# Altium schematic sheet Tegra_CSI.SchDoc
size A4
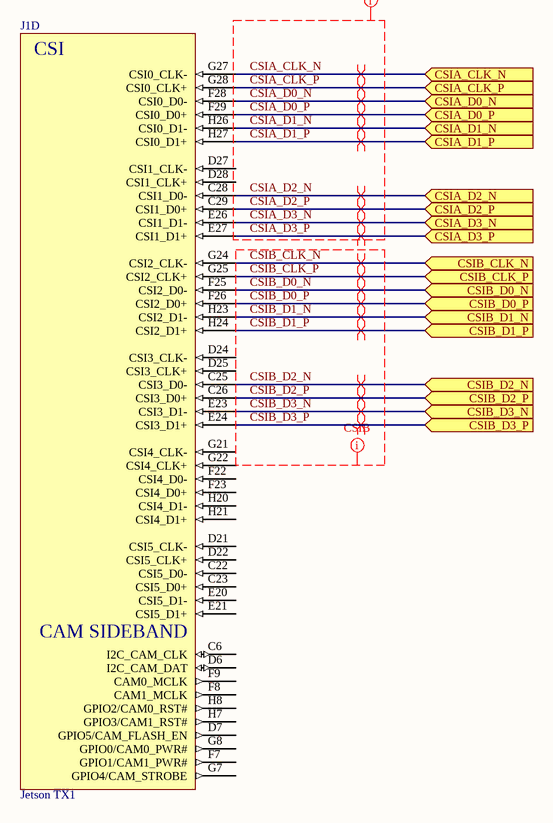
[diagram p0: Tegra_CSI.SchDoc]

## Parts
J1  Jetson TX1  [Nvidia Jetson TX1]  (part D of 14)

## Ports
CSIA_CLK_N (in), CSIA_CLK_P (in), CSIA_D0_N (in), CSIA_D0_P (in), CSIA_D1_N (in), CSIA_D1_P (in), CSIA_D2_N (in), CSIA_D2_P (in), CSIA_D3_N (in), CSIA_D3_P (in), CSIB_CLK_N (in), CSIB_CLK_P (in), CSIB_D0_N (in), CSIB_D0_P (in), CSIB_D1_N (in), CSIB_D1_P (in), CSIB_D2_N (in), CSIB_D2_P (in), CSIB_D3_N (in), CSIB_D3_P (in)

## Nets
CSIA_CLK_N: J1.G27(CSI0_CLK-) ; port CSIA_CLK_N
CSIA_CLK_P: J1.G28(CSI0_CLK+) ; port CSIA_CLK_P
CSIA_D0_N: J1.F28(CSI0_D0-) ; port CSIA_D0_N
CSIA_D0_P: J1.F29(CSI0_D0+) ; port CSIA_D0_P
CSIA_D1_N: J1.H26(CSI0_D1-) ; port CSIA_D1_N
CSIA_D1_P: J1.H27(CSI0_D1+) ; port CSIA_D1_P
CSIA_D2_N: J1.C28(CSI1_D0-) ; port CSIA_D2_N
CSIA_D2_P: J1.C29(CSI1_D0+) ; port CSIA_D2_P
CSIA_D3_N: J1.E26(CSI1_D1-) ; port CSIA_D3_N
CSIA_D3_P: J1.E27(CSI1_D1+) ; port CSIA_D3_P
CSIB_CLK_N: J1.G24(CSI2_CLK-) ; port CSIB_CLK_N
CSIB_CLK_P: J1.G25(CSI2_CLK+) ; port CSIB_CLK_P
CSIB_D0_N: J1.F25(CSI2_D0-) ; port CSIB_D0_N
CSIB_D0_P: J1.F26(CSI2_D0+) ; port CSIB_D0_P
CSIB_D1_N: J1.H23(CSI2_D1-) ; port CSIB_D1_N
CSIB_D1_P: J1.H24(CSI2_D1+) ; port CSIB_D1_P
CSIB_D2_N: J1.C25(CSI3_D0-) ; port CSIB_D2_N
CSIB_D2_P: J1.C26(CSI3_D0+) ; port CSIB_D2_P
CSIB_D3_N: J1.E23(CSI3_D1-) ; port CSIB_D3_N
CSIB_D3_P: J1.E24(CSI3_D1+) ; port CSIB_D3_P

Not connected (* = marked no-connect by the designer): J1 C6(I2C_CAM_CLK) C22(CSI5_D0-) C23(CSI5_D0+) D6(I2C_CAM_DAT) D7(GPIO5/CAM_FLASH_EN) D21(CSI5_CLK-) D22(CSI5_CLK+) D24(CSI3_CLK-) D25(CSI3_CLK+) D27(CSI1_CLK-) D28(CSI1_CLK+) E20(CSI5_D1-) E21(CSI5_D1+) F7(GPIO1/CAM1_PWR#) F8(CAM1_MCLK) F9(CAM0_MCLK) F22(CSI4_D0-) F23(CSI4_D0+) G7(GPIO4/CAM_STROBE) G8(GPIO0/CAM0_PWR#) G21(CSI4_CLK-) G22(CSI4_CLK+) H7(GPIO3/CAM1_RST#) H8(GPIO2/CAM0_RST#) H20(CSI4_D1-) H21(CSI4_D1+)

## Layout directives
differential pair: CSIA_CLK_N, CSIA_CLK_P, CSIA_D0_N, CSIA_D0_P, CSIA_D1_N, CSIA_D1_P, CSIA_D2_N, CSIA_D2_P, CSIA_D3_N, CSIA_D3_P, CSIB_CLK_N, CSIB_CLK_P, CSIB_D0_N, CSIB_D0_P, CSIB_D1_N, CSIB_D1_P, CSIB_D2_N, CSIB_D2_P, CSIB_D3_N, CSIB_D3_P
net class CSIA: CSIA_CLK_N, CSIA_CLK_P, CSIA_D0_N, CSIA_D0_P, CSIA_D1_N, CSIA_D1_P, CSIA_D2_N, CSIA_D2_P, CSIA_D3_N, CSIA_D3_P
net class CSIB: CSIB_CLK_N, CSIB_CLK_P, CSIB_D0_N, CSIB_D0_P, CSIB_D1_N, CSIB_D1_P, CSIB_D2_N, CSIB_D2_P, CSIB_D3_N, CSIB_D3_P

## Notes on the sheet
- (in symbol NVIDIA_Jetson_TX1, part D) CSI; CAM SIDEBAND

## Library data of the parts
J1 = NVIDIA_Jetson_TX1: Nvidia computing module